# EAGLE design template (EAGLE 9.0.0)
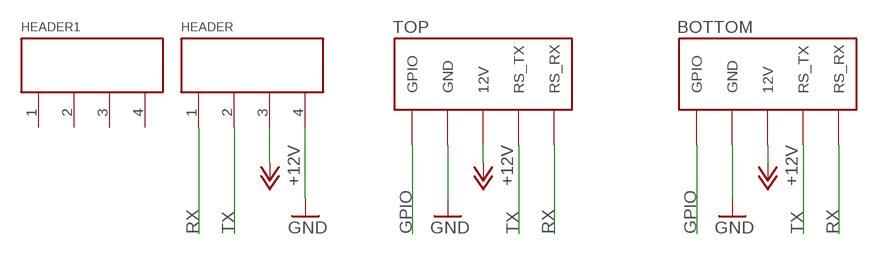
[diagram p0: schematic, sheet 1]

## Parts
BOTTOM  STEROWNIK-PINY_5PIN_BOTTOM  [STEROWNIK-PINY_5PIN_BOTTOM]
HEADER  TBMP5104RO-KF  [TBMP5104RO-KF]
HEADER1  TBMP5104RO-KF  [TBMP5104RO-KF]
TOP  STEROWNIK-PINY_5PIN  [STEROWNIK-PINY_5PIN]

## Nets
+12V: BOTTOM.12(12V) HEADER.3 TOP.12V
GND: BOTTOM.GND HEADER.4 TOP.GND
GPIO: BOTTOM.GPIO1(GPIO) TOP.GPIO1(GPIO)
RX: BOTTOM.RS_RX HEADER.1 TOP.RS_RX
TX: BOTTOM.RS_TX HEADER.2 TOP.RS_TX
Unconnected: HEADER1.1 HEADER1.2 HEADER1.3 HEADER1.4

## Library data of the parts
BOTTOM = pcb:STEROWNIK-PINY_5PIN_BOTTOM
HEADER HEADER1 = con-kaifeng-508:TBMP5104RO-KF
TOP = pcb:STEROWNIK-PINY_5PIN

## Net classes
0 default: width 0.406 mm

## Board
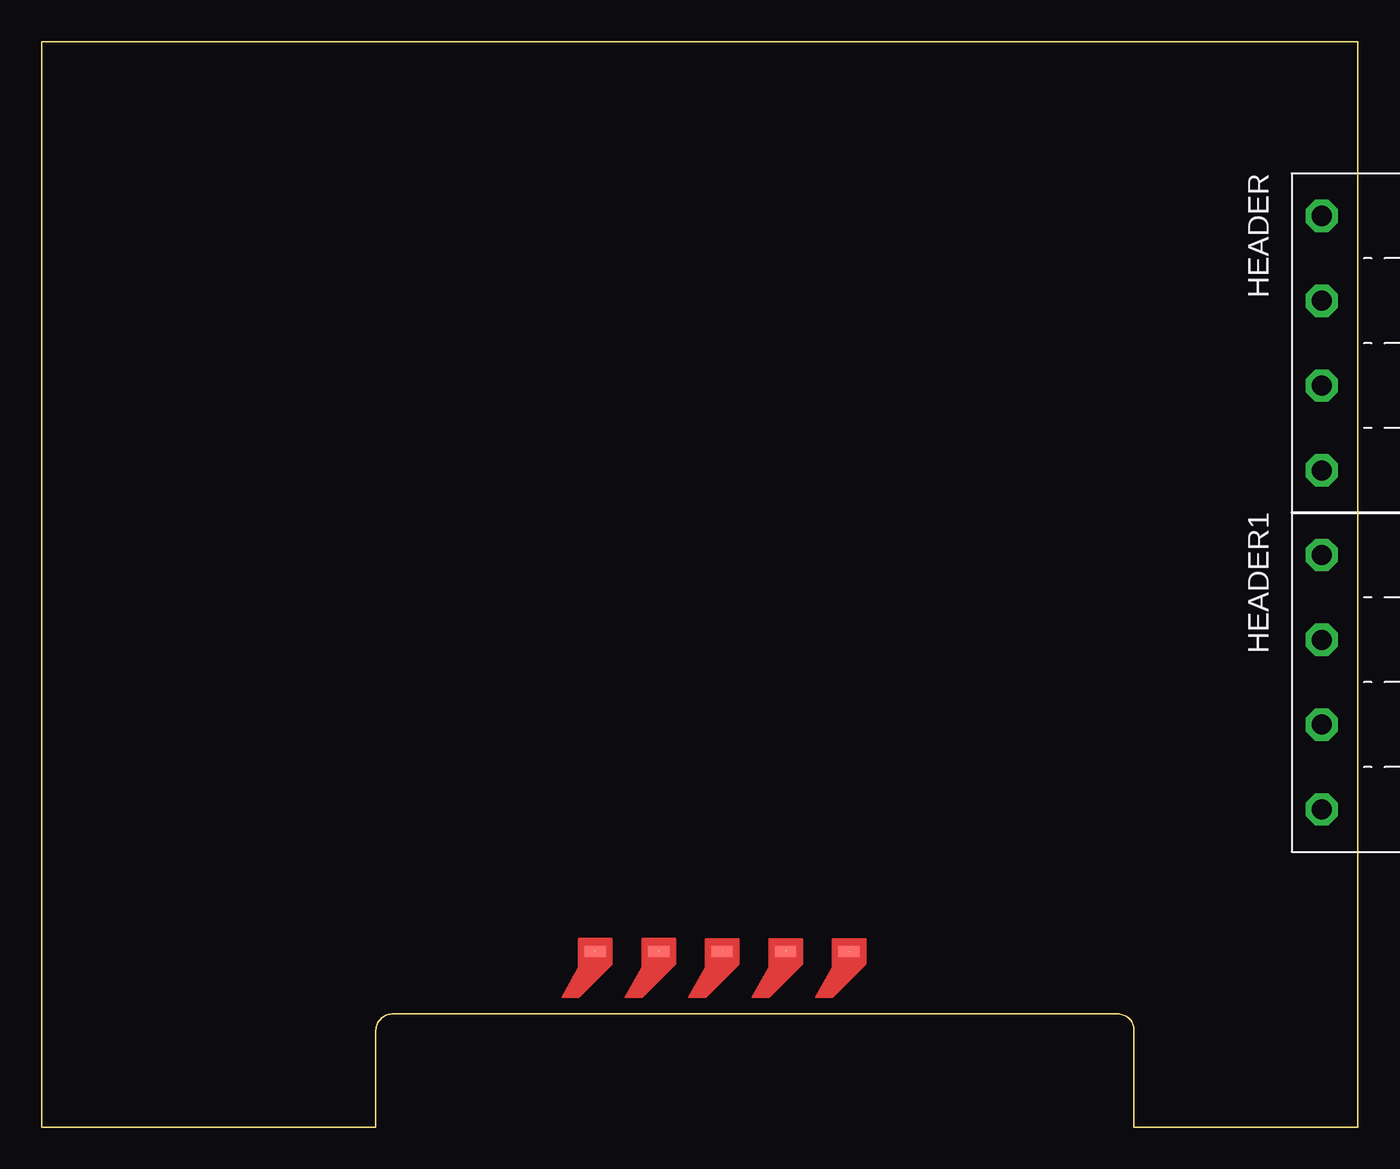
[diagram p1: board, top side]
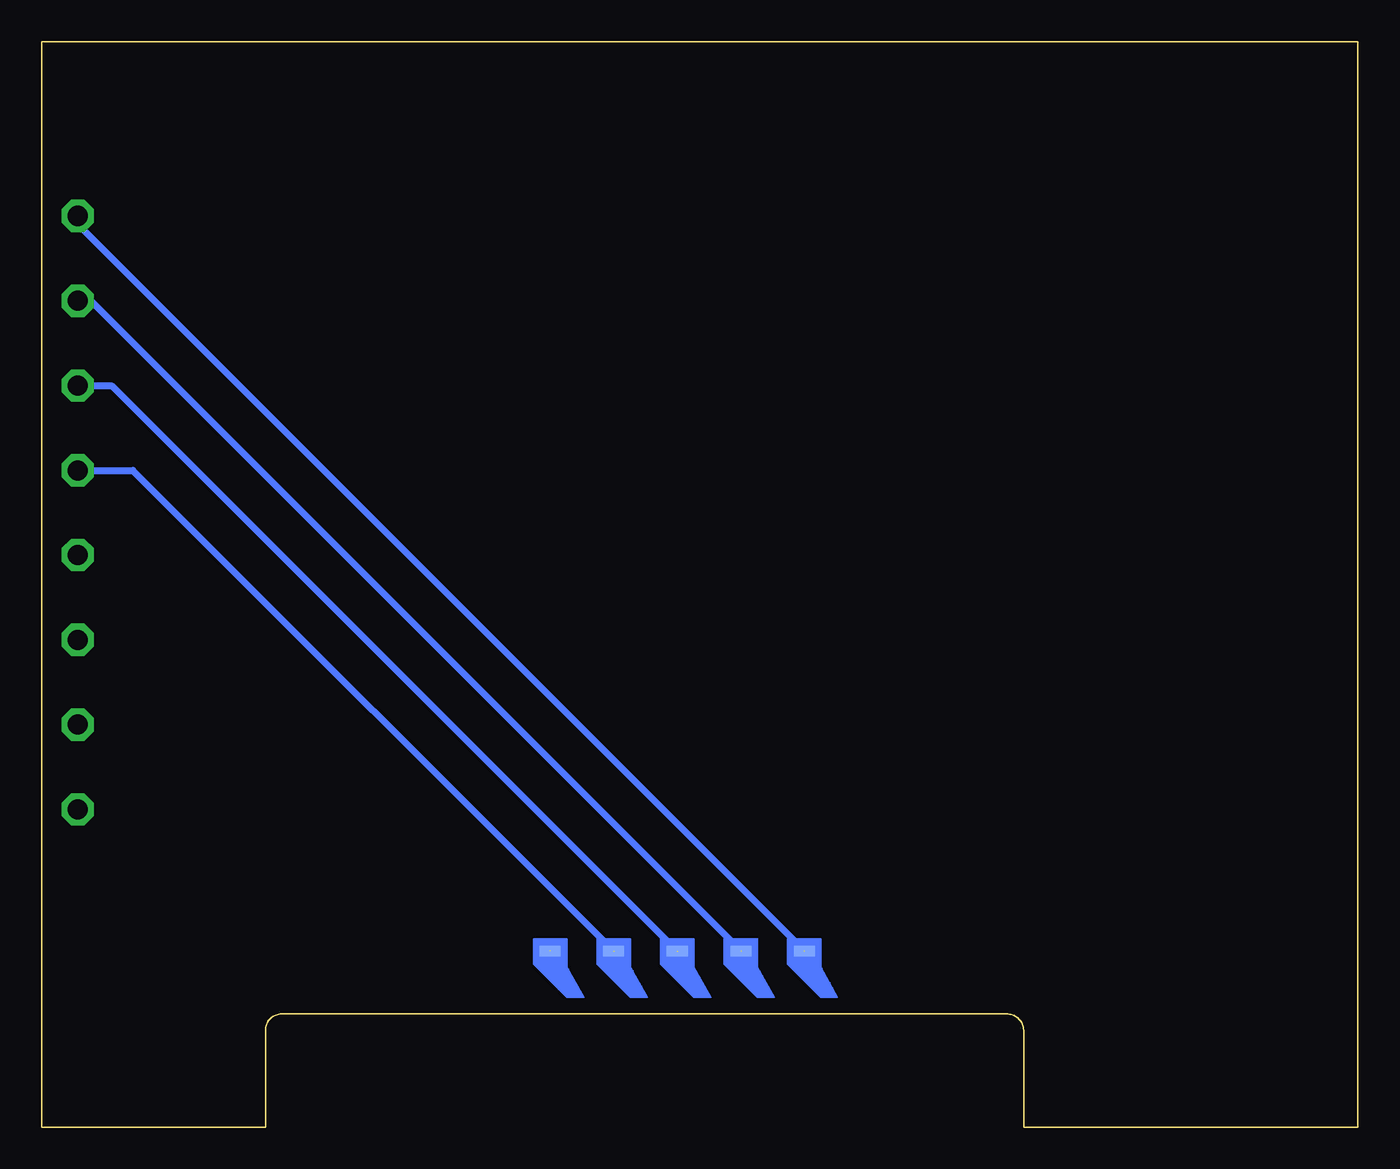
[diagram p2: board, bottom side, seen from below]

Size 78.8 x 65 mm. Coordinates in mm from the lower left corner, seen from the top.
Outline: 78.8,65 0,65 0,0 20,0 20,5.8 arc-90 21.04,6.78 64.44,6.78 arc-90 65.4,5.8 65.4,0 78.8,0 78.8,65
Copper layers (1*16): Top 0.035mm / dielectric 1.5mm / Bottom 0.035mm
Design rules "default": minimum track width 10mil, minimum drill 24mil, track to track 8mil, track to pad 8mil, pad to pad 8mil, via to via 8mil, smd to smd 8mil, copper to edge 40mil, drill to drill 8mil, minimum pad ring 10mil, minimum via ring 8mil, stop-mask expansion 4mil, vias tented up to drill 0mil, thermal gap 10mil
bKeepout: area 38.2,62.6 to 40.6,65; area 0,57 to 5,58.5; area 73.8,57 to 78.8,58.5; area 3.8,0 to 5.2,1.9; area 73.5,0 to 75,1.9

### Footprints (pad centres in the part's own frame; a part is rotated, then mirrored left to right if it is on the bottom)
STEROWNIK-PINY_5PIN_BOTTOM = smd 1.27 x 0.635 bottom: 12 -0.5,1; GND -4.3,1; GPIO1 -8.1,1; RS_RX 7.1,1; RS_TX 3.3,1
TBMP5104RO-KF = drill 1.2 pad 1.93 octagon: 1 -7.62,0; 2 -2.54,0; 3 2.54,0; 4 7.62,0
STEROWNIK-PINY_5PIN = smd 1.27 x 0.635: 12V -0.508,1.016; GND -4.318,1.016; GPIO1 -8.128,1.016; RS_RX 7.112,1.016; RS_TX 3.302,1.016

### Placement (x,y rotation side)
BOTTOM  40.24,9.53 0 bottom
HEADER  76.65,46.95 270 top
HEADER1  76.65,26.65 270 top
TOP  40.24,9.53 0 bottom

### Tracks (layer width: path | path; a pad name or v marks a point on that pad's centre or on a via)
+12V  (1 unrouted)
  Bottom 0.406: HEADER.3 74.61,44.41 TOP.12V
GND  (1 unrouted)
  Bottom 0.406: HEADER.4 73.34,39.33 TOP.GND
GPIO  (1 unrouted)
RX  (1 unrouted)
  Bottom 0.406: HEADER.1 76.65,54.07 TOP.RS_RX
TX  (1 unrouted)
  Bottom 0.406: HEADER.2 75.88,49.49 TOP.RS_TX

### Text on the board
Measures: FRONT-PANEL